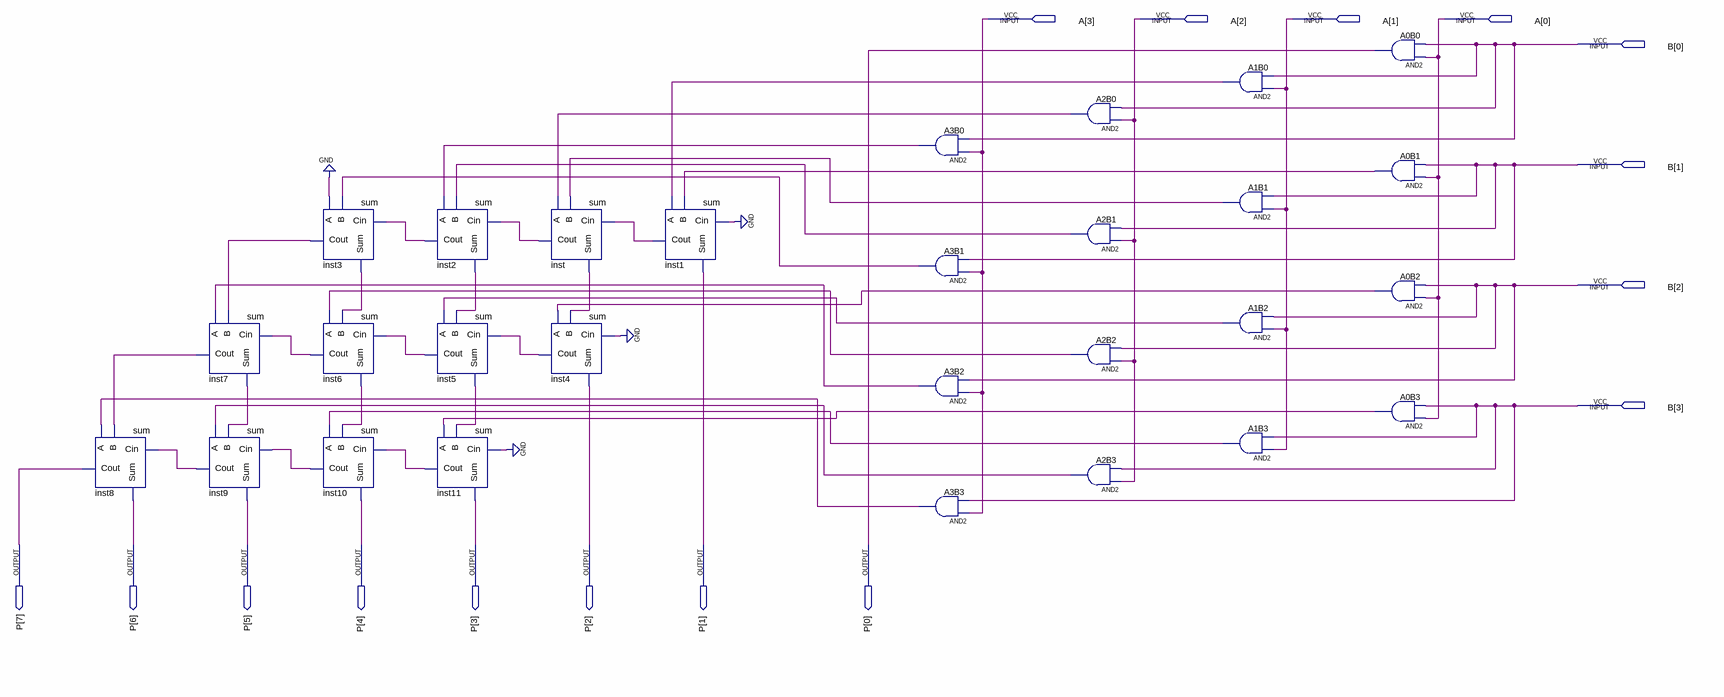
[diagram p0: schematic sheet]
// Quartus schematic MUL4.bdf as structural Verilog: 28 symbols, 16 pins
module MUL4 (
  input  [3:0] A,
  input  [3:0] B,
  output [7:0] P
);

  wire A0B1_out, A0B2_out, A0B3_out, A1B0_out, A1B1_out, A1B2_out, A1B3_out, A2B0_out, A2B1_out, A2B2_out,
       A2B3_out, A3B0_out, A3B1_out, A3B2_out, A3B3_out, inst1_cout, inst2_cout, inst2_sum, inst3_cout,
       inst3_sum, inst4_cout, inst5_cout, inst5_sum, inst6_cout, inst6_sum, inst7_cout, inst7_sum,
       inst9_cout, inst10_cout, inst11_cout, inst_cout, inst_sum;

  sum inst8 (.A(A3B3_out), .B(inst7_cout), .Cin(inst9_cout), .Cout(P[7]), .Sum(P[6]));
  sum inst7 (.A(A3B2_out), .B(inst3_cout), .Cin(inst6_cout), .Cout(inst7_cout), .Sum(inst7_sum));
  sum inst9 (.A(A2B3_out), .B(inst7_sum), .Cin(inst10_cout), .Cout(inst9_cout), .Sum(P[5]));
  sum inst3 (.A(1'b0), .B(A3B1_out), .Cin(inst2_cout), .Cout(inst3_cout), .Sum(inst3_sum));
  sum inst6 (.A(A2B2_out), .B(inst3_sum), .Cin(inst5_cout), .Cout(inst6_cout), .Sum(inst6_sum));
  sum inst10 (.A(A1B3_out), .B(inst6_sum), .Cin(inst11_cout), .Cout(inst10_cout), .Sum(P[4]));
  sum inst2 (.A(A3B0_out), .B(A2B1_out), .Cin(inst_cout), .Cout(inst2_cout), .Sum(inst2_sum));
  sum inst5 (.A(A1B2_out), .B(inst2_sum), .Cin(inst4_cout), .Cout(inst5_cout), .Sum(inst5_sum));
  sum inst11 (.A(A0B3_out), .B(inst5_sum), .Cin(1'b0), .Cout(inst11_cout), .Sum(P[3]));
  sum inst (.A(A2B0_out), .B(A1B1_out), .Cin(inst1_cout), .Cout(inst_cout), .Sum(inst_sum));
  sum inst4 (.A(A0B2_out), .B(inst_sum), .Cin(1'b0), .Cout(inst4_cout), .Sum(P[2]));
  sum inst1 (.A(A1B0_out), .B(A0B1_out), .Cin(1'b0), .Cout(inst1_cout), .Sum(P[1]));
  and A3B0 (A3B0_out, A[3], B[0]);
  and A3B1 (A3B1_out, A[3], B[1]);
  and A3B2 (A3B2_out, A[3], B[2]);
  and A3B3 (A3B3_out, A[3], B[3]);
  and A2B0 (A2B0_out, A[2], B[0]);
  and A2B1 (A2B1_out, A[2], B[1]);
  and A2B2 (A2B2_out, A[2], B[2]);
  and A2B3 (A2B3_out, A[2], B[3]);
  and A1B0 (A1B0_out, A[1], B[0]);
  and A1B1 (A1B1_out, A[1], B[1]);
  and A1B2 (A1B2_out, A[1], B[2]);
  and A1B3 (A1B3_out, A[1], B[3]);
  and A0B0 (P[0], A[0], B[0]);
  and A0B1 (A0B1_out, A[0], B[1]);
  and A0B2 (A0B2_out, A[0], B[2]);
  and A0B3 (A0B3_out, A[0], B[3]);
endmodule
